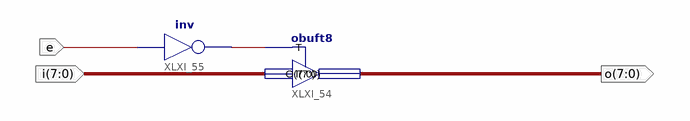
[diagram p0: schematic sheet 1]
// Xilinx ISE schematic buffer_8bit.sch (aspartan6) as structural Verilog: 2 symbols, 3 ports
module buffer_8bit (
  input  e,
  input  [7:0] i,
  output [7:0] o
);

  wire XLXN_2;

  obuft8 XLXI_54 (.I(i), .T(XLXN_2), .O(o));
  not XLXI_55 (XLXN_2, e);
endmodule
